# EAGLE design B684J (EAGLE 6.6.0)
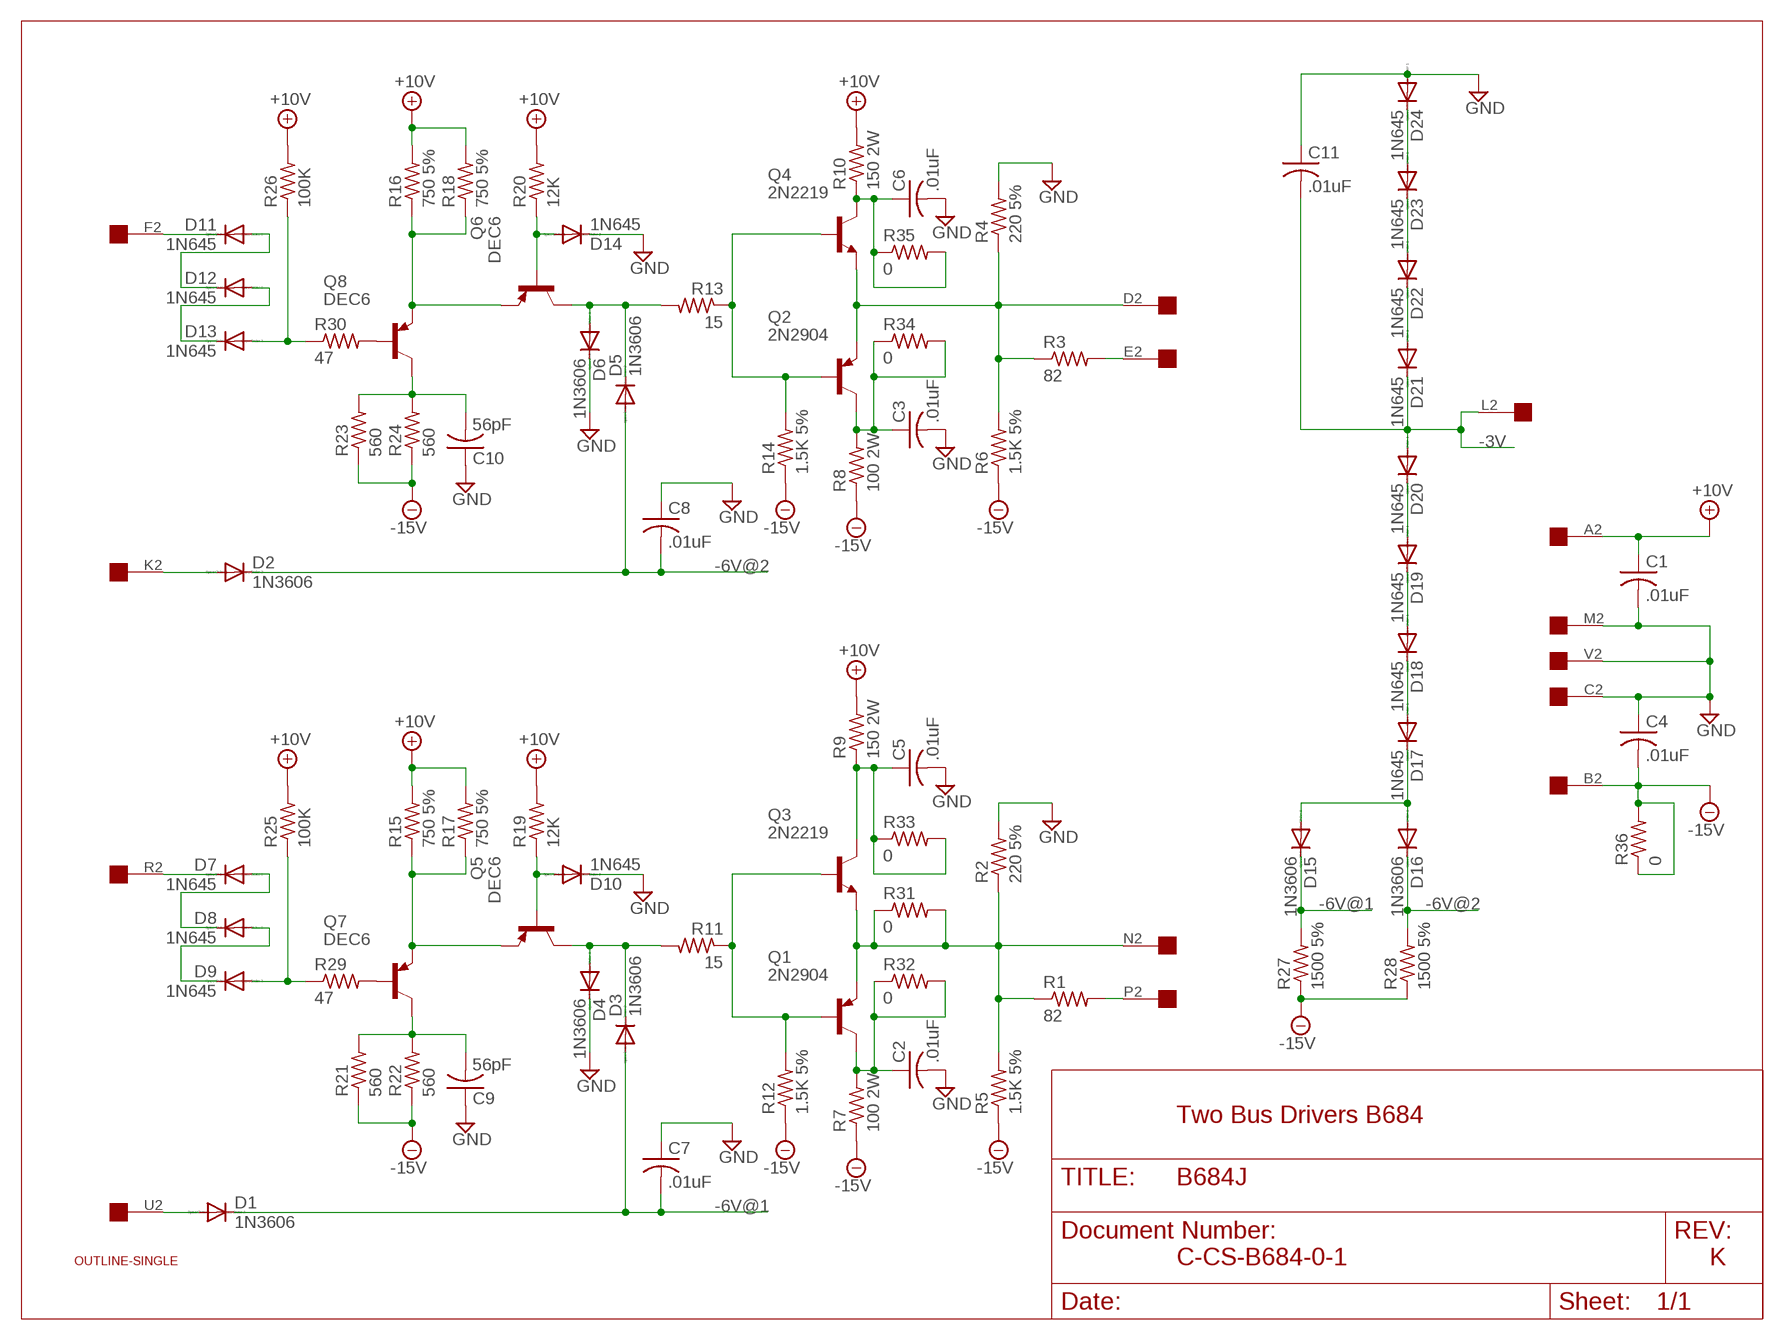
[diagram p0: schematic, sheet 1]

## Parts
C1  .01uF  C-US  [C063-025X075]
C2  .01uF  C-US  [C063-025X075]
C3  .01uF  C-US  [C063-025X075]
C4  .01uF  C-US  [C063-025X075]
C5  .01uF  C-US  [C063-025X075]
C6  .01uF  C-US  [C063-025X075]
C7  .01uF  C-US  [C063-025X075]
C8  .01uF  C-US  [C063-025X075]
C9  56pF  C-US  [C063-025X075]
C10  56pF  C-US  [C063-025X075]
C11  .01uF  C-US  [C063-025X075]
D1  1N3606  1N4148DO35-10  [DO35-10]
D2  1N3606  1N4148DO35-10  [DO35-10]
D3  1N3606  1N4148DO35-10  [DO35-10]
D4  1N3606  1N4148DO35-10  [DO35-10]
D5  1N3606  1N4148DO35-10  [DO35-10]
D6  1N3606  1N4148DO35-10  [DO35-10]
D7  1N645  1N4148DO35-10  [DO35-10]
D8  1N645  1N4148DO35-10  [DO35-10]
D9  1N645  DIODE-DO35-10  [DO35-10]
D10  1N645  1N4148DO35-10  [DO35-10]
D11  1N645  1N4148DO35-10  [DO35-10]
D12  1N645  1N4148DO35-10  [DO35-10]
D13  1N645  DIODE-DO35-10  [DO35-10]
D14  1N645  1N4148DO35-10  [DO35-10]
D15  1N3606  1N4148DO35-10  [DO35-10]
D16  1N3606  1N4148DO35-10  [DO35-10]
D17  1N645  1N4148DO35-10  [DO35-10]
D18  1N645  1N4148DO35-10  [DO35-10]
D19  1N645  1N4148DO35-10  [DO35-10]
D20  1N645  1N4148DO35-10  [DO35-10]
D21  1N645  1N4148DO35-10  [DO35-10]
D22  1N645  1N4148DO35-10  [DO35-10]
D23  1N645  1N4148DO35-10  [DO35-10]
D24  1N645  1N4148DO35-10  [DO35-10]
Q1  2N2904  2N3637  [TO39]
Q2  2N2904  2N3637  [TO39]
Q3  2N2219  [TO5]
Q4  2N2219  [TO5]
Q5  DEC6  2N3637  [TO39]
Q6  DEC6  2N3637  [TO39]
Q7  DEC6  2N3637  [TO39]
Q8  DEC6  2N3637  [TO39]
R1  82  R-US_0207/10  [0207/10]
R2  220 5%  R-US_0207/10  [0207/10]
R3  82  R-US_0207/10  [0207/10]
R4  220 5%  R-US_0207/10  [0207/10]
R5  1.5K 5%  R-US_0207/10  [0207/10]
R6  1.5K 5%  R-US_0207/10  [0207/10]
R7  100 2W  R-US_0817/22  [P0817/22]
R8  100 2W  R-US_0817/22  [P0817/22]
R9  150 2W  R-US_0817/22  [P0817/22]
R10  150 2W  R-US_0817/22  [P0817/22]
R11  15  R-US_0207/10  [0207/10]
R12  1.5K 5%  R-US_0207/10  [0207/10]
R13  15  R-US_0207/10  [0207/10]
R14  1.5K 5%  R-US_0207/10  [0207/10]
R15  750 5%  R-US_0207/10  [0207/10]
R16  750 5%  R-US_0207/10  [0207/10]
R17  750 5%  R-US_0207/10  [0207/10]
R18  750 5%  R-US_0207/10  [0207/10]
R19  12K  R-US_0207/10  [0207/10]
R20  12K  R-US_0207/10  [0207/10]
R21  560  R-US_0207/10  [0207/10]
R22  560  R-US_0207/10  [0207/10]
R23  560  R-US_0207/10  [0207/10]
R24  560  R-US_0207/10  [0207/10]
R25  100K  R-US_0207/10  [0207/10]
R26  100K  R-US_0207/10  [0207/10]
R27  1500 5%  R-US_0207/10  [0207/10]
R28  1500 5%  R-US_0207/10  [0207/10]
R29  47  R-US_0207/10  [0207/10]
R30  47  R-US_0207/10  [0207/10]
R31  0  R-US_0207/10  [0207/10]
R32  0  R-US_0207/10  [0207/10]
R33  0  R-US_0207/10  [0207/10]
R34  0  R-US_0207/10  [0207/10]
R35  0  R-US_0207/10  [0207/10]
R36  0  R-US_0207/10  [0207/10]
U$1  OUTLINE-SINGLE  [SINGLE]
U$2  EDGE-1  [EDGE-CON1]

## Nets
+10V [Power]: C1.1 R9.2 R10.2 R15.2 R16.2 R17.2 R18.2 R19.2 R20.2 R25.2 R26.2 U$2.A2
-3V [Power]: C11.2 D20.A D21.C U$2.L2
-6V@1: C7.2 D1.C D3.A D15.C R27.2
-6V@2: C8.2 D2.C D5.A D16.C R28.2
-15V [Power]: C4.2 R5.1 R6.1 R7.1 R8.1 R12.1 R14.1 R21.1 R22.1 R23.1 R24.1 R27.1 R28.1 R36.1 R36.2 U$2.B2
GND [Power]: C1.2 C2.2 C3.2 C4.1 C5.2 C6.2 C7.1 C8.1 C9.1 C10.1 C11.1 D4.C D6.C D10.C D14.C D24.A R2.2 R4.2 U$2.C2 U$2.M2 U$2.V2
N$1: D11.C U$2.F2
N$2: D11.A D12.C
N$3: D13.A R26.1 R30.1
N$4: D12.A D13.C
N$5: Q7.2(B) R29.2
N$6: C10.2 Q8.3(C) R23.2 R24.2
N$7: Q6.1(E) Q8.1(E) R16.1 R18.1
N$8: D14.A Q6.2(B) R20.1
N$9: Q2.1(E) Q4.1(E) R3.1 R4.1 R6.2 U$2.D2
N$10: C6.1 Q4.3(C) R10.1 R35.1 R35.2
N$11: C3.1 Q2.3(C) R8.2 R34.1 R34.2
N$12: D18.A D19.C
N$13: D22.A D23.C
N$14: D5.C D6.A Q6.3(C) R13.2
N$15: Q2.2(B) Q4.2(B) R13.1 R14.2
N$16: D21.A D22.C
N$17: D2.A U$2.K2
N$18: R3.2 U$2.E2
N$19: D7.C U$2.R2
N$20: D17.A D18.C
N$21: D7.A D8.C
N$22: D8.A D9.C
N$23: D9.A R25.1 R29.1
N$24: D19.A D20.C
N$25: Q8.2(B) R30.2
N$26: C9.2 Q7.3(C) R21.2 R22.2
N$27: Q5.1(E) Q7.1(E) R15.1 R17.1
N$28: D10.A Q5.2(B) R19.1
N$29: D3.C D4.A Q5.3(C) R11.2
N$30: Q1.2(B) Q3.2(B) R11.1 R12.2
N$31: D1.A U$2.U2
N$32: D15.A D16.A D17.C
N$33: Q1.1(E) Q3.1(E) R1.1 R2.1 R5.2 R31.1 R31.2 U$2.N2
N$35: C2.1 Q1.3(C) R7.2 R32.1 R32.2
N$36: R1.2 U$2.P2
N$37: D23.A D24.C
N$38: C5.1 Q3.3(C) R9.1 R33.1 R33.2
Unconnected: U$2.H2 U$2.J2 U$2.S2 U$2.T2

## Notes on the sheet
- Two Bus Drivers B684
- C-CS-B684-0-1 | K

## Library data of the parts
C1-C11 = dec-con:C-US: Capacitors with funky DEC lead spacing.
D1-D8 D10-D12 D14-D24 = diode:1N4148: DIODE high speed (Philips)
D9 D13 = diode:DIODE-: DIODE
Q1 Q2 Q5-Q8 = transistor-pnp:2N3637*: PNP Transistror
Q3 Q4 = transistor:2N2219: NPN TRANSISTOR
R1-R36 = rcl:R-US_: RESISTOR, American symbol
U$1 = dec-con:OUTLINE-*: Board outlines for DEC boards.
U$2 = dec-con:EDGE-1: Single-Sided DEC Edge Connector -- (side 2)

## Net classes
1 Power: width 0.813 mm

## Board
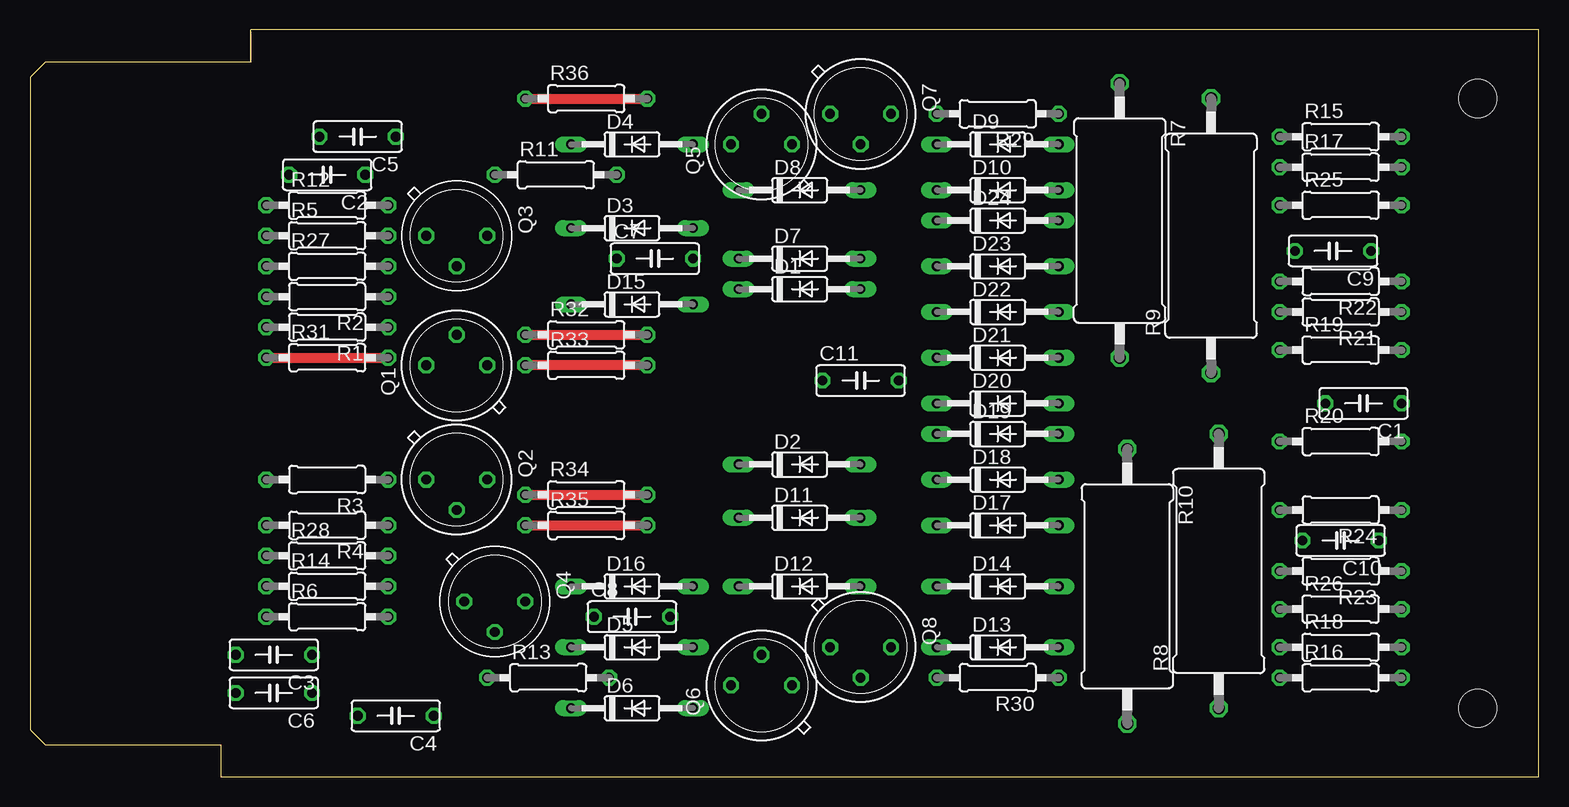
[diagram p1: board, top side]
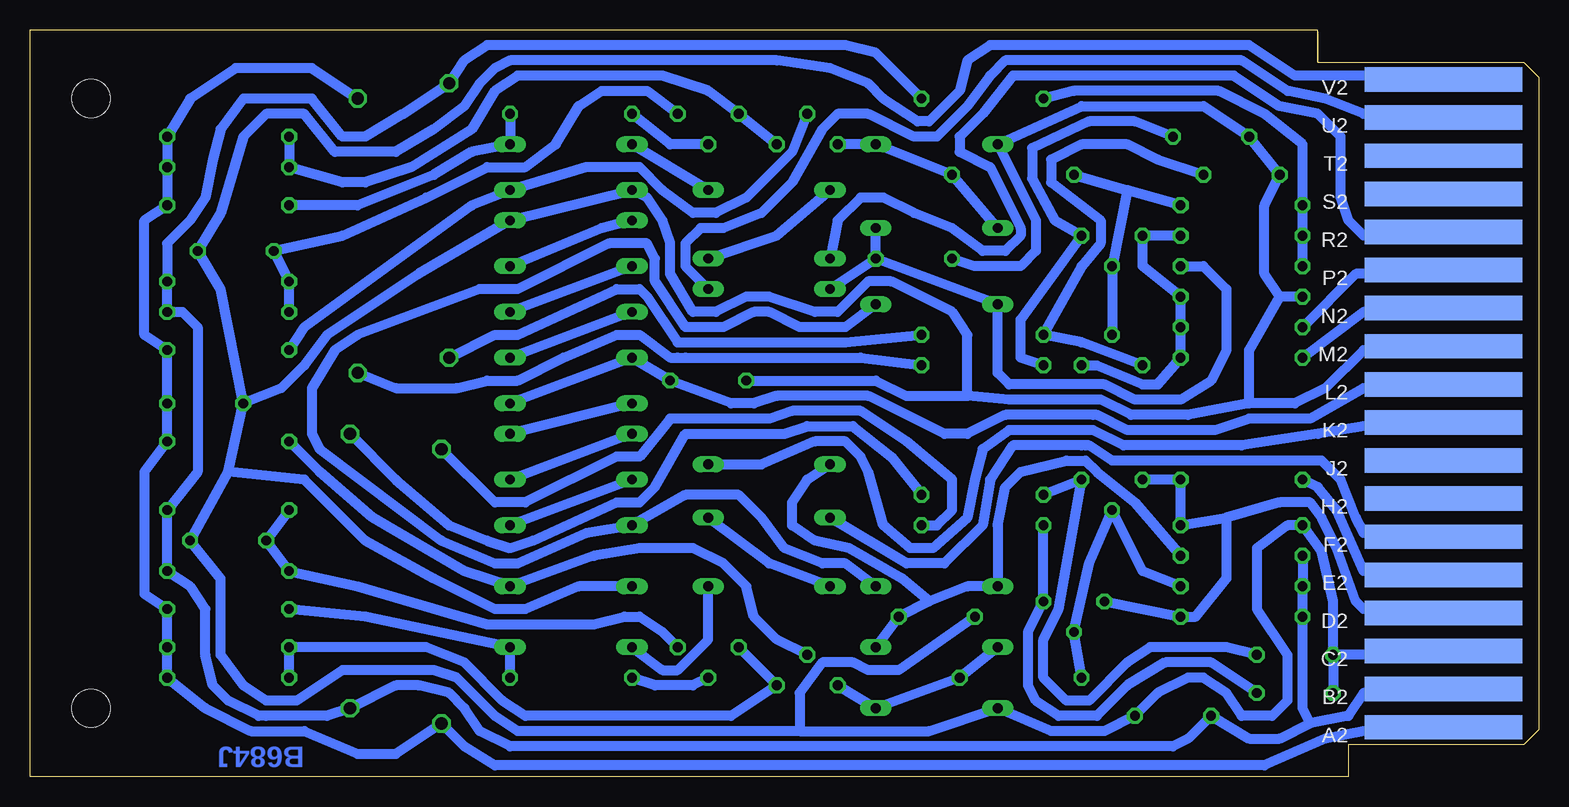
[diagram p2: board, bottom side, seen from below]

Size 125.73 x 62.23 mm. Coordinates in mm from the lower left corner, seen from the top.
Copper layers (1+16): Top 0.035mm / dielectric 1.5mm / Bottom 0.035mm
Design rules "16mils": minimum track width 16mil, minimum drill 32mil, track to track 15mil, track to pad 10mil, pad to pad 10mil, via to via 10mil, smd to smd 10mil, copper to edge 13mil, drill to drill 10mil, minimum pad ring 10mil, minimum via ring 8mil, stop-mask expansion 0mil, vias tented up to drill 0mil, thermal gap 10mil

### Footprints (pad centres in the part's own frame; a part is rotated, then mirrored left to right if it is on the bottom)
C063-025X075 = drill 0.813 octagon: 1 -2.54,0; 2 3.81,0
DO35-10 = drill 0.813 long: A 5.08,0; C -5.08,0
TO39 = drill 0.813 octagon: 1 0,-2.54; 2 2.54,0; 3 0,2.54
TO5 = drill 0.813 octagon: 1 0,-2.54; 2 2.54,0; 3 0,2.54
0207/10 = drill 0.813 octagon: 1 -5.08,0; 2 5.08,0
P0817/22 = drill 1.016 octagon: 1 -11.43,0; 2 11.43,0
SINGLE = hole 3.175: 120.65,56.515; 120.65,5.715
EDGE-CON1 = smd 13.106 x 2.032 bottom: A2 7.938,4.128; B2 7.938,7.303; C2 7.938,10.477; D2 7.938,13.652; E2 7.938,16.828; F2 7.938,20.003; H2 7.938,23.177; J2 7.938,26.352; K2 7.938,29.527; L2 7.938,32.703; M2 7.938,35.877; N2 7.938,39.053; P2 7.938,42.227; R2 7.938,45.403; S2 7.938,48.578; T2 7.938,51.752; U2 7.938,54.928; V2 7.938,58.102

### Placement (x,y rotation side)
C1  111.76,31.11 180 top
C2  25.4,50.16 180 top
C3  20.96,10.16 180 top
C4  31.12,5.08 180 top
C5  27.94,53.34 180 top
C6  20.96,6.99 180 top
C7  51.44,43.18 0 top
C8  49.53,13.34 0 top
C9  109.22,43.81 180 top
C10  109.86,19.68 180 top
C11  68.58,33.02 0 top
D1  64.14,40.64 0 top
D2  64.14,26.04 0 top
D3  50.17,45.72 0 top
D4  50.17,52.7 0 top
D5  50.17,10.79 0 top
D6  50.17,5.71 0 top
D7  64.14,43.18 0 top
D8  64.14,48.9 0 top
D9  80.65,52.7 0 top
D10  80.65,48.9 0 top
D11  64.14,21.59 0 top
D12  64.14,15.88 0 top
D13  80.65,10.79 0 top
D14  80.65,15.88 0 top
D15  50.17,39.37 0 top
D16  50.17,15.88 0 top
D17  80.65,20.95 0 top
D18  80.65,24.77 0 top
D19  80.65,28.57 0 top
D20  80.65,31.11 0 top
D21  80.65,34.92 0 top
D22  80.65,38.73 0 top
D23  80.65,42.55 0 top
D24  80.65,46.35 0 top
Q1  35.56,34.29 90 top
Q2  35.56,24.77 270 top
Q3  35.56,45.09 270 top
Q4  38.74,14.61 270 top
Q5  60.96,52.7 90 top
Q6  60.96,7.62 90 top
Q7  69.22,55.24 270 top
Q8  69.22,10.79 270 top
R1  24.77,37.47 180 top
R2  24.77,40.01 180 top
R3  24.77,24.77 180 top
R4  24.77,20.95 180 top
R5  24.77,45.09 0 top
R6  24.77,13.34 0 top
R7  90.81,46.35 270 top
R8  99.06,17.14 90 top
R9  98.43,45.09 90 top
R10  91.44,15.88 270 top
R11  43.82,50.16 0 top
R12  24.77,47.62 0 top
R13  43.18,8.26 0 top
R14  24.77,15.88 0 top
R15  109.22,53.34 0 top
R16  109.22,8.26 0 top
R17  109.22,50.8 0 top
R18  109.22,10.79 0 top
R19  109.22,35.56 0 top
R20  109.22,27.94 0 top
R21  109.22,38.73 180 top
R22  109.22,41.27 180 top
R23  109.22,17.14 180 top
R24  109.22,22.23 180 top
R25  109.22,47.62 0 top
R26  109.22,13.97 0 top
R27  24.77,42.55 0 top
R28  24.77,18.41 0 top
R29  80.65,55.24 180 top
R30  80.65,8.26 180 top
R31  24.77,34.92 0 top
R32  46.36,36.83 0 top
R33  46.36,34.29 0 top
R34  46.36,23.5 0 top
R35  46.36,20.95 0 top
R36  46.36,56.52 0 top
U$1  0,0 0 top
U$2  0,0 0 top

### Tracks (layer width: path | path; a pad name or v marks a point on that pad's centre or on a via)
+10V
  Bottom 0.813: U$2.A2 8.89,3.81 14.61,3.81 17.78,3.17 22.86,0.95 87,0.95 89.54,2.54 R10.2 95.25,1.91 98.43,1.91 102.87,3.81 107.32,3.81 111.13,5.71 R16.2 R18.2 R26.2 116.21,15.24 116.21,25.4 R20.2 C1.1 R19.2 116.21,36.83 116.21,46.35 R25.2 R17.2 R15.2 112.4,56.52 108.59,59.05 102.24,59.05 R9.2
-3V
  Bottom 0.813: D20.A D21.C C11.2 67.31,31.11 65.41,31.11 63.5,31.75 55.88,31.75 49.53,28.57 47.63,28.57 44.45,30.16 37.15,30.16 36.83,30.16 34.29,28.89 26.99,28.89 24.13,29.84 19.05,29.84 14.61,32.38 8.89,32.38 U$2.L2
-6V@1
  Bottom 0.813: R27.2 27.94,42.55 26.04,40.64 26.04,35.56 27.31,33.02 29.85,31.43 33.66,31.43 36.2,32.7 44.13,32.7 45.09,33.66 D15.C C7.2 | C7.2 D3.A | C7.2 D1.C
-6V@2
  Bottom 0.813: R28.2 33.66,22.86 36.83,25.4 37.78,26.35 39.37,26.35 43.18,25.4 44.45,24.13 45.09,20.95 D16.C 47.63,15.88 50.8,14.61 | D5.A C8.2 50.8,14.61 | 50.8,14.61 53.02,16.51 57.47,19.05 60.33,19.68 62.23,20.95 62.23,22.86 60.96,24.77 D2.C
-15V
  Top 0.813: R36.1 R36.2
  Bottom 0.813: R27.1 R5.1 R12.1 19.69,52.7 22.86,55.24 26.67,57.15 38.74,57.15 R36.1 | U$2.B2 8.89,6.99 14.61,6.99 15.88,5.08 19.05,4.45 | 19.05,4.45 19.69,5.71 R6.1 R14.1 R28.1 | 19.05,4.45 21.59,3.17 24.13,3.17 C4.2 29.21,3.17 30.48,2.54 85.73,2.54 88.27,3.81 89.54,5.71 90.81,6.99 93.35,7.62 95.25,7.62 R8.1 100.97,5.08 106.05,5.08 106.68,5.08 109.22,6.35 110.49,7.62 111.13,10.16 111.13,13.97 112.4,15.88 R23.1 R24.1 111.76,25.4 111.76,37.47 113.03,38.73 R21.1 R22.1 114.3,44.45 112.4,46.35 111.13,48.26 110.49,51.44 109.86,53.98 107.95,56.52 102.24,56.52 99.7,53.34 97.79,53.34 94.62,55.24 R7.1 89.54,59.69 87.63,60.96 57.79,60.96 55.25,60.33 R36.2
GND
  Bottom 0.813: R2.2 21.59,40.01 | 21.59,40.01 22.86,41.91 22.86,47.62 C2.2 C5.2 27.94,55.88 38.1,55.88 D4.C 41.91,46.35 41.91,43.81 43.18,42.55 46.99,42.55 C7.1 | U$2.M2 9.53,35.56 14.61,35.56 17.78,32.38 20.32,31.11 24.13,31.11 | 24.13,31.11 24.13,35.56 21.59,40.01 | U$2.C2 8.89,10.16 C3.2 | C3.2 C6.2 | C3.2 17.15,14.61 18.1,18.73 R4.2 20.96,20.95 23.5,19.05 23.5,13.97 20.96,10.16 20.96,6.35 22.23,5.08 24.77,5.08 26.04,6.99 27.94,8.26 29.21,8.26 31.75,6.99 C4.1 36.2,3.81 40.64,3.81 D6.C 50.8,3.81 61.6,3.81 | 24.13,31.11 29.21,30.16 33.97,30.16 36.51,31.43 44.13,31.43 47.63,31.75 | 47.63,31.75 47.63,36.83 48.9,38.73 53.98,41.27 55.88,41.27 58.42,38.73 60.33,38.73 64.14,40.01 66.04,40.01 68.58,38.73 70.49,38.73 72.39,41.91 72.39,44.45 73.03,46.35 74.3,48.26 D10.C D24.A 93.35,41.91 100.97,36.83 102.87,34.29 104.78,32.38 C1.2 | C11.1 55.25,33.02 52.71,31.75 47.63,31.75 | U$2.V2 8.89,58.42 20.32,58.42 24.13,60.96 45.72,60.96 47.63,59.69 48.26,57.15 50.8,54.61 51.75,54.61 54.61,56.52 55.88,57.78 59.06,59.05 63.5,59.69 85.73,59.69 87,59.05 88.27,57.78 89.54,55.88 92.08,53.98 95.25,52.07 100.33,52.07 102.87,55.24 106.05,55.24 107.95,53.34 109.86,46.99 C9.1 109.86,40.64 C1.2 | 109.22,25.4 C10.1 109.86,16.51 109.86,10.16 107.95,7.62 106.05,6.35 103.51,6.35 99.7,8.89 92.08,8.89 90.17,8.26 87,5.08 85.09,3.81 61.6,3.81 | 109.22,25.4 C1.2 | C8.1 53.34,8.89 55.88,8.89 57.15,9.53 59.69,9.53 61.6,6.99 61.6,3.81 | D14.C 80.01,15.88 84.46,13.97 87,13.97 92.08,16.51 97.79,19.68 102.87,24.77 109.22,25.4
N$1
  Bottom 0.813: U$2.F2 8.89,20.32 14.61,20.32 15.24,21.59 16.51,24.77 18.1,26.35 35.56,26.35 37.47,27.62 37.78,27.62 38.1,27.62 43.82,27.62 45.72,24.77 46.36,20.95 49.53,17.78 52.71,17.78 D11.C
N$2
  Bottom 0.813: D12.C 64.14,17.78 D11.A
N$3
  Bottom 0.813: R30.1 D13.A 97.79,13.34 R26.1
N$4
  Bottom 0.813: D13.C 73.03,8.89 71.76,8.89 69.22,11.43 D12.A
N$5
  Bottom 0.813: Q7.2 72.39,52.7 R29.2
N$6
  Bottom 0.813: R24.2 C10.2 R23.2 98.43,15.88 87.63,12.7 78.74,12.7 76.2,13.34 74.93,13.34 73.03,12.06 Q8.3
N$7
  Bottom 0.813: R16.1 R18.1 92.71,10.79 89.54,9.53 86.36,6.35 84.46,5.08 67.31,5.08 Q6.1 Q8.1
N$8
  Bottom 0.813: R20.1 101.6,25.4 97.16,21.59 89.54,17.14 D14.A 78.74,18.41 74.93,19.05 70.49,19.05 67.95,17.78 66.04,15.88 65.41,13.34 63.5,11.43 Q6.2
N$9
  Bottom 0.813: U$2.D2 8.89,13.97 14.61,13.97 15.24,14.61 16.83,19.05 18.1,21.59 19.05,22.86 21.59,22.86 26.04,21.59 | 26.04,21.59 26.04,16.51 28.58,13.34 R6.2 Q4.1 | 26.04,21.59 R4.1 R3.1 Q2.1
N$10
  Top 0.813: R35.1 R35.2
  Bottom 0.813: R35.1 Q4.3 42.55,12.06 42.55,7.62 41.91,6.35 40.01,5.08 36.83,5.08 34.29,7.62 31.12,9.53 27.31,9.53 C6.1 | R35.2 50.17,20.95 48.9,22.23 48.9,24.77 52.71,27.94 56.52,30.48 62.23,30.48 64.14,29.84 72.39,29.84 74.93,26.67 76.84,26.67 84.46,22.86 87,22.86 R10.1
N$11
  Top 0.813: R34.1 R34.2
  Bottom 0.813: R34.1 Q2.3 40.01,13.97 41.28,11.43 41.28,8.26 39.37,6.35 37.47,6.35 34.29,9.53 32.39,10.79 26.04,10.79 C3.1 | R8.2 95.25,24.77 90.81,20.95 87.63,19.68 85.73,19.05 83.82,19.68 76.84,22.86 74.93,22.86 73.66,24.13 71.12,28.57 62.87,28.57 60.96,29.21 57.15,29.21 53.98,26.67 R34.2
N$12
  Bottom 0.813: D19.C D18.A
N$13
  Bottom 0.813: D23.C D22.A
N$14
  Bottom 0.813: D5.C R13.2 D6.A Q6.3
N$15
  Bottom 0.813: R14.2 33.02,17.14 Q2.2 37.47,17.78 Q4.2 R13.1
N$16
  Bottom 0.813: D22.C D21.A
N$17
  Bottom 0.813: U$2.K2 8.89,29.53 8.89,29.21 14.61,29.21 18.42,28.57 24.77,27.62 34.61,27.62 37.15,28.89 37.47,28.89 44.13,28.89 46.36,27.3 46.99,24.77 47.63,21.59 50.48,19.05 52.39,19.05 54.61,20.95 55.88,25.4 56.52,26.67 57.79,27.94 60.33,27.94 64.77,26.04 D2.A
N$18
  Bottom 0.813: U$2.E2 8.89,17.14 14.61,17.14 16.83,22.23 18.42,24.13 R3.2
N$19
  Bottom 0.813: U$2.R2 8.89,45.09 14.61,45.09 15.88,46.35 16.51,48.26 16.51,53.34 18.42,55.24 21.59,55.88 25.4,58.42 43.82,58.42 46.36,55.24 48.26,53.34 48.26,52.07 45.72,50.8 43.18,45.72 43.18,45.09 44.45,43.81 46.36,43.81 48.9,45.72 52.07,46.99 54.61,48.26 56.52,48.26 58.42,46.35 D7.C
N$20
  Bottom 0.813: D18.C D17.A
N$21
  Bottom 0.813: D8.C 63.5,45.09 D7.A
N$22
  Bottom 0.813: D8.A D9.C
N$23
  Bottom 0.813: R29.1 D9.A 88.9,52.07 92.08,50.16 98.43,47.62 R25.1
N$24
  Bottom 0.813: D20.C D19.A
N$25
  Bottom 0.813: Q8.2 70.49,7.62 73.66,7.62 R30.2
N$26
  Bottom 0.813: R21.2 R22.2 C9.2 99.7,45.09 92.71,48.26 87.63,50.8 84.46,50.8 81.92,52.7 80.01,55.88 78.11,57.15 74.3,57.15 Q7.3
N$27
  Bottom 0.813: Q5.1 Q7.1 69.22,57.15 73.03,58.42 85.09,58.42 87,57.15 88.9,53.98 93.98,50.8 97.79,49.53 99.7,49.53 R17.1 R15.1
N$28
  Bottom 0.813: R19.1 102.87,37.47 88.9,47.62 D10.A 79.38,50.8 74.93,50.8 73.03,48.9 70.49,46.99 68.58,46.99 66.04,48.26 62.23,52.07 Q5.2
N$29
  Bottom 0.813: D3.C R11.2 D4.A Q5.3
N$30
  Bottom 0.813: R12.2 34.29,48.9 | 34.29,48.9 Q3.2 Q1.2 | R11.1 34.29,48.9
N$31
  Bottom 0.813: U$2.U2 8.26,55.24 14.61,55.24 17.78,56.52 20.96,57.15 24.77,59.69 44.45,59.69 45.72,58.42 47.63,55.88 50.17,53.34 52.07,53.34 55.88,55.24 58.42,55.24 59.69,53.98 62.23,49.53 64.77,46.99 67.95,45.72 69.85,45.72 71.12,44.45 71.12,42.55 D1.A
N$32
  Bottom 0.813: D16.A 57.79,17.78 59.69,17.78 62.87,19.05 64.77,21.59 66.68,23.5 71.12,23.5 D17.C 79.38,20.32 85.09,17.78 87,17.78 91.44,19.68 101.6,27.3 102.24,28.57 102.24,32.38 100.33,35.56 98.43,36.83 88.27,40.64 85.09,40.64 77.47,44.45 74.3,44.45 73.66,43.18 73.66,41.27 71.12,37.47 67.95,37.47 65.41,38.73 64.14,38.73 61.6,37.47 57.79,37.47 D15.A
N$33
  Top 0.813: R31.1 R31.2
  Bottom 0.813: U$2.N2 9.53,38.73 14.61,38.73 R31.1 | R5.2 Q3.1 33.02,42.55 R2.1 R1.1 R31.2 31.75,32.7 33.02,32.7 36.83,34.29 37.15,34.29 Q1.1
N$35
  Top 0.813: R32.1 R32.2
  Bottom 0.813: Q1.3 38.1,36.2 R32.1 38.1,42.55 36.51,44.45 36.51,46.35 40.64,49.53 40.64,51.44 38.1,52.7 34.29,52.7 31.75,51.44 C2.1 | R7.2 87,36.83 85.09,36.83 76.84,40.64 74.93,40.64 74.3,40.01 71.76,36.2 57.79,36.2 R32.2
N$36
  Bottom 0.813: U$2.P2 8.89,41.91 15.24,41.91 R1.2
N$37
  Bottom 0.813: D24.C 78.11,45.72 D23.A
N$38
  Top 0.813: R33.2 R33.1
  Bottom 0.813: R33.1 43.18,34.92 43.18,38.1 Q3.3 40.32,46.35 42.23,49.85 42.23,52.39 37.47,54.61 33.66,54.61 C5.1 | R9.1 95.25,32.38 90.17,32.38 87.63,33.02 85.09,33.02 81.28,34.92 76.84,36.83 74.93,36.83 72.39,34.92 71.76,34.92 71.12,34.92 56.52,34.92 R33.2

### Text on the board
Bottom: B684J